# Altium project LUMO_SQUISHO.PrjPcb
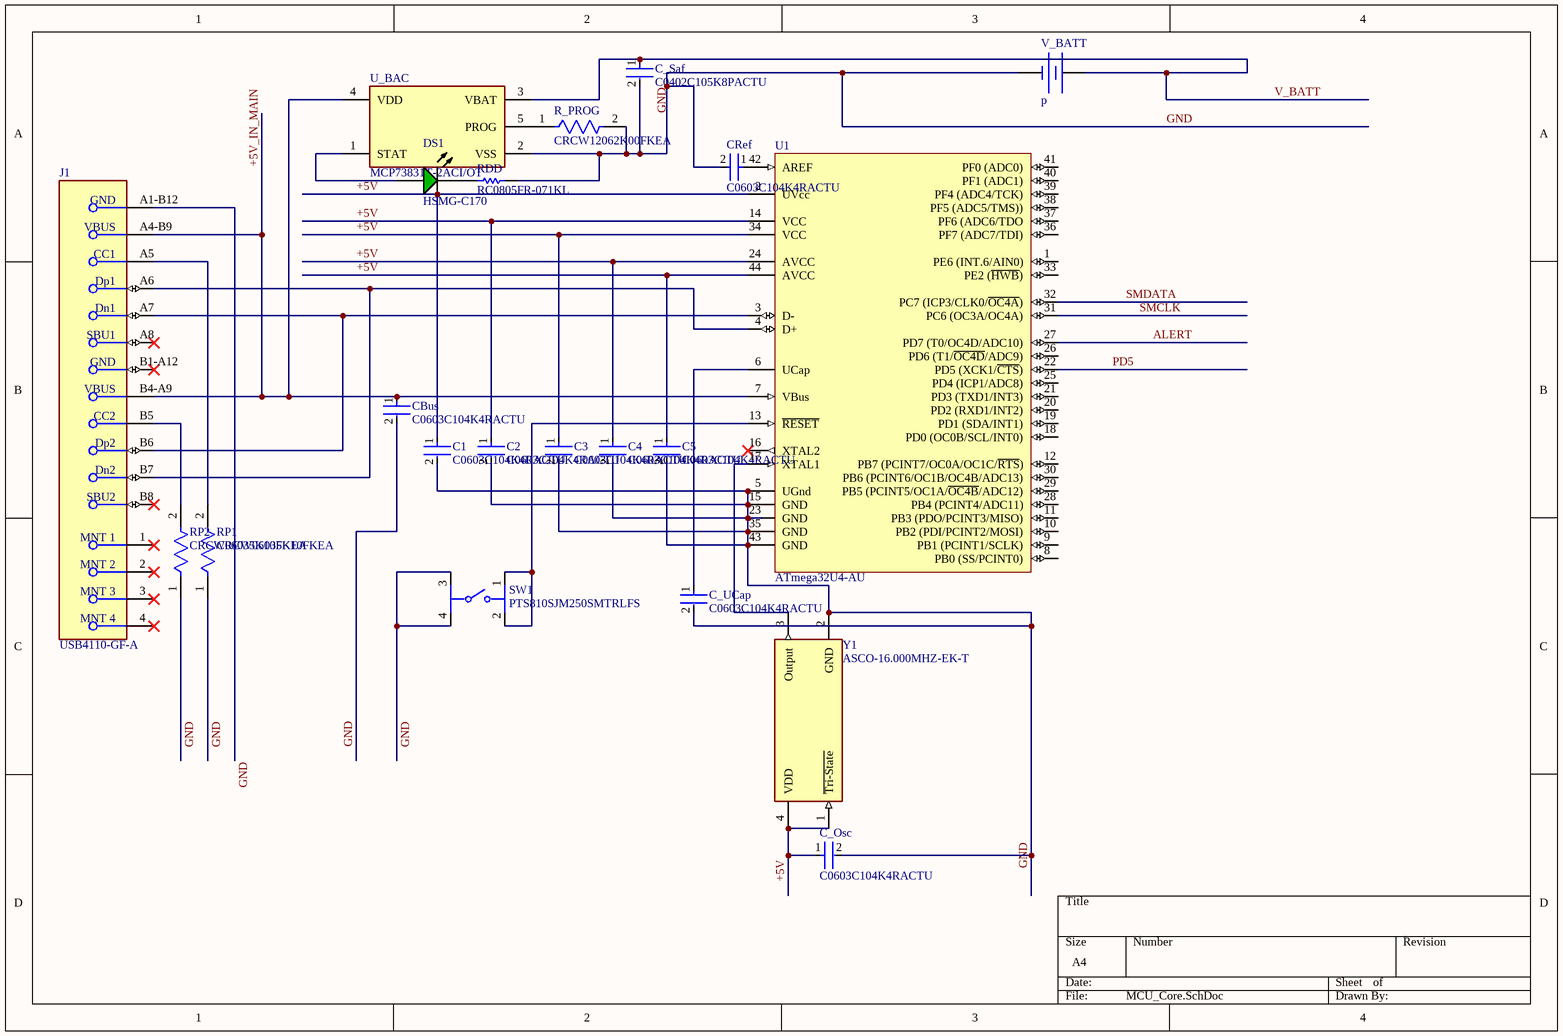
[diagram p0: MCU_Core.SchDoc]
2 sheets, 37 parts. Net scope: global (net labels, ports and power ports of the same name join across sheets).
Board file: PCBMAIN.PcbDoc
Sheets:
  MCU_Core.SchDoc
  LED_Interface.SchDoc

## Sheet MCU_Core.SchDoc
size A4; SheetNumber: 1; SheetTotal: 2

### Parts
C1  C0603C104K4RACTU  [FP-C0603C-CF-MFG]
C2  C0603C104K4RACTU  [FP-C0603C-CF-MFG]
C3  C0603C104K4RACTU  [FP-C0603C-CF-MFG]
C4  C0603C104K4RACTU  [FP-C0603C-CF-MFG]
C5  C0603C104K4RACTU  [FP-C0603C-CF-MFG]
C_Osc  C0603C104K4RACTU  [FP-C0603C-CF-MFG]
C_Saf  C0402C105K8PACTU  [FP-C0402C105K8PACTU-MFG]
C_UCap  C0603C104K4RACTU  [FP-C0603C-CF-MFG]
CBus  C0603C104K4RACTU  [FP-C0603C-CF-MFG]
CRef  C0603C104K4RACTU  [FP-C0603C-CF-MFG]
DS1  HSMG-C170  [AVAG-HSMX-C170_V]
J1  USB4110-GF-A  [FP-USB4110-GF-A-MFG]
R_PROG  CRCW12062K00FKEA  [FP-CRCW1206-e3-IPC_A]
RDD  RC0805FR-071KL  [RESC2013X60X35ML10T20]
RP1  CRCW06035K10FKEA  [FP-CRCW0603-e3-IPC_C]
RP2  CRCW06035K10FKEA  [FP-CRCW0603-e3-IPC_C]
SW1  PTS810SJM250SMTRLFS  [FP-PTS810SJM250SMTRLFS-MFG]
U1  ATmega32U4-AU  [44ML_M]
U_BAC  MCP73831T-2ACI/OT  [FP-C04-091-OT-IPC_B]
V_BATT  DC Magnitude: p  (hidden comment: Constant Voltage Source)
Y1  ASCO-16.000MHZ-EK-T  [FP-ASCO-MFG]

### Nets
GND: C1.2 C2.2 C3.2 C4.2 C5.2 C_Osc.2 C_Saf.2 C_UCap.2 CBus.2 CRef.2 J1.A1-B12(GND) R_PROG.2 RDD.2 RP1.1 RP2.1 SW1.3 SW1.4 U1.5(UGnd) U1.15(GND) U1.23(GND) U1.35(GND) U1.43(GND) U_BAC.2(VSS) V_BATT.2 Y1.2(GND)
+5V: C1.1 C2.1 C3.1 C4.1 C5.1 C_Osc.1 U1.2(UVcc) U1.14(VCC) U1.24(AVCC) U1.34(VCC) U1.44(AVCC) Y1.1(~{Tri-State}) Y1.4(VDD)
+5V_IN_MAIN: CBus.1 J1.A4-B9(VBUS) J1.B4-A9(VBUS) U1.7(VBus) U_BAC.4(VDD)
ALERT: U1.27(PD7_(T0/OC4D/ADC10))
PD5: U1.22(PD5_(XCK1/~{CTS}))
SMCLK: U1.31(PC6_(OC3A/OC4A))
SMDATA: U1.32(PC7_(ICP3/CLK0/~{OC4A}))
V_BATT: C_Saf.1 U_BAC.3(VBAT) V_BATT.1
NetC_UCap_1: C_UCap.1 U1.6(UCap)
NetCRef_1: CRef.1 U1.42(AREF)
NetDS1_1: DS1.1(A) U_BAC.1(STAT)
NetDS1_2: DS1.2(K) RDD.1
NetJ1_A5: J1.A5(CC1) RP1.2
NetJ1_A6: J1.A6(Dp1) J1.B7(Dn2) U1.4(D+)
NetJ1_A7: J1.A7(Dn1) J1.B6(Dp2) U1.3(D-)
NetJ1_B5: J1.B5(CC2) RP2.2
NetR_PROG_1: R_PROG.1 U_BAC.5(PROG)
NetSW1_1: SW1.1 SW1.2 U1.13(~{RESET})
NetU1_17: U1.17(XTAL1) Y1.3(Output)

Not connected (* = marked no-connect by the designer): J1 1(MNT_1)* 2(MNT_2)* 3(MNT_3)* 4(MNT_4)* A8(SBU1)* B1-A12(GND)* B8(SBU2)*; U1 1(PE6_(INT.6/AIN0)) 8(PB0_(SS/PCINT0)) 9(PB1_(PCINT1/SCLK)) 10(PB2_(PDI/PCINT2/MOSI)) 11(PB3_(PDO/PCINT3/MISO)) 12(PB7_(PCINT7/OC0A/OC1C/~{RTS})) 16(XTAL2)* 18(PD0_(OC0B/SCL/INT0)) 19(PD1_(SDA/INT1)) 20(PD2_(RXD1/INT2)) 21(PD3_(TXD1/INT3)) 25(PD4_(ICP1/ADC8)) 26(PD6_(T1/~{OC4D}/ADC9)) 28(PB4_(PCINT4/ADC11)) 29(PB5_(PCINT5/OC1A/~{OC4B}/ADC12)) 30(PB6_(PCINT6/OC1B/OC4B/ADC13)) 33(PE2_(~{HWB})) 36(PF7_(ADC7/TDI)) 37(PF6_(ADC6/TDO) 38(PF5_(ADC5/TMS))) 39(PF4_(ADC4/TCK)) 40(PF1_(ADC1)) 41(PF0_(ADC0))

### Notes on the sheet
- Labels drawn without touching a wire or pin: GND

### Library data of the parts
C1-C5 C_Osc C_UCap CBus CRef = CMP-2006-03811-3: Capacitor; Ceramic; Cap; .100uF; Tol 10%; SMT; Vol-Rtg 16V; X7R; Tape and Reel; Manufacturer: KEMET; Value: 0.10 μF; Temperature Coefficient: 30ppm/°C; Automotive Grade: Grade 1; Tolerance: 0.1; Digikey Description: Capacitor; Ceramic; Cap; .100uF; Tol 10%; SMT; Vol-Rtg 16V; X7R; Tape and Reel; Automotive: Yes; Temperature Range High: +125°C; Device Class L1: Passive Components; Material: Ceramic; Lead Free: Yes; Device Class L2: Capacitors; Capacitance: 0.10 μF; Height: 0.87mm; Voltage Rating: 16 V; Manufacturer Part Number: C0603C104K4RACTU; Octopart: https://octopart.com/c0603c104k4ractu-kemet-93067; Package: C0603C-CF; Temperature Characteristic: X7R; Device Class L3: Ceramic Capacitors; ComponentLink2URL: https://api.kemet.com/component-edge/download/datasheet/C0603C100J5GACAUTO.pdf; Temperature Range Low: -55°C; ComponentLink2Description: Datasheet; Mouser Description: Multilayer Ceramic Capacitors MLCC - SMD/SMT 16volts 0.1uF 10% X7R 10%; RoHS: TRUE; Temperature: -55°C to +125°C; Category: Cap
C_Saf = CMP-2008-02081-2: CAP CER 1UF 10V X5R 0402; Dielectric Material: Ceramic; Dissipation Factor: 5%; Tolerance: 10%; Number of Pins: 2; Contact Plating: Tin; Min Operating Temperature: -55°C; Termination: SMD/SMT; Lead Free: Lead Free; Construction: Flat; Voltage Rating (DC): 10V; Mount: Surface Mount; Series: C; Thickness: 0.022inch; Width: 0.5mm; Radiation Hardening: No; Capacitance: 1uF; Dielectric: X5R; Height: 0.5mm; Voltage: 10V; Length: 1mm; Depth: 0.5mm; Max Operating Temperature: 85°C; Package Quantity: 1; Packaging: Tape and Reel; RoHS Compliant: Yes; Case Code (Imperial): 0402; Case Code (Metric): 1005; REACH SVHC: No SVHC; Voltage Rating: 10V; Case/Package: 0402
DS1 = CMP-2000-05062-1: Chip LED, Green, 2.2 V, -40 to 85 degC, 2-Pin SMD, Pb-Free, Tape and Reel; Manufacturer: Avago; No. of Pins: 2; Peak Wavelength: 570nm; SVHC: NoSVHC(16-Jun-2014); Dominant Wavelength: 572nm; Forward Current If: 20mA; Viewing Angle: 170deg; Lens Shape: Rectangular; PIV Max: 5V; External Width: 1.25mm; LED Type: Standard; External Depth: 0.8mm; Opto Mounting Orientation: Top; Luminous Intensity: 15mcd; Luminous Intensity Min: 4mcd; Forward Voltage VF Max: 2.6V; External Length / Height: 2mm; Bulb Size: 1.25mmx1.4mm; Light Area Height: 1mm; Voltage Vf Typ: 2.2V; Operating Temperature Max: 85degC; Datasheet Version: Oct-08; MSL: MSL2A-4weeks; Peak Forward Current: 20mA; Package Description: 2-Pin Surface Mount Device, Body 2 x 1.25 mm, Height 0.8 mm; Datasheet URL: https://datasheet.ciiva.com/29280/180495-da-01-en-chip-led-hsmg-c170-gelb-gruen-29280971.pdf; Storage Temperature Min: -40degC; LED Colour: Green; Wavelength Typ: 570nm; Mounting Type: SMD; Forward Current If Max: 20mA; Dominant Wavelength Typ: 572nm; LED Mounting: SMD; Operating Temperature Range: -30degCto+85degC; Operating Temperature Min: -30degC; Manufacturer URL: http://www.avagotech.com/; Packaging: CutTape; Luminous Intensity Typ: 15mcd; Package Reference: HSMX-C170; Storage Temperature Max: 85degC; Opto Case Style: SMD; Forward Voltage: 2.2V
J1 = CMP-245163-000002-1: CONN USB 2.0 TYPE-C R/A SMT; Manufacturer: GCT; Conn Orientation: Right Angle; Usb Standard: USB 2.0; Voltage Rating: 20V; Current Rating: 3/4.25/1.25/0.25A; Number Of Contacts: 16; Is Female: yes; Shielding: true; Standoff Height: 0.1mm; Octopart: https://octopart.com/usb4110-gf-a-gct-103941985; Temperature: -40°C to +85°C; RoHS: TRUE; Automotive: No; Contact Material: Gold,Nickel; Device Class L1: Connectors; Device Class L2: USB Connectors; Package: 0; Lead Free: Yes; ComponentLink2URL: https://gct.co/files/drawings/usb4110.pdf; Temperature Range High: +85°C; Temperature Range Low: -40°C; Height: 3.46mm; Manufacturer Part Number: USB4110-GF-A; ComponentLink2Description: Datasheet; Device Class L3: unset; Digikey Description: CONN USB 2.0 TYPE-C R/A SMT; Category: Conn
R_PROG = CMP-1014-00542-3: RES Thick Film, 2kΩ, 1%, 0.25W, 100ppm/°C, 1206; Max Power Dissipation: 250mW; Voltage Rating: 200V; Resistance: 2kR; Package Quantity: 10; Height: 0.55mm; Tolerance: 1%; Number of Terminations: 2; Mount: Surface Mount; Width: 1.6mm; Length: 3.2mm; Features: Automotive AEC-Q200; Contact Plating: Tin; Number of Pins: 2; Weight: 0.000353oz; Max Operating Temperature: 155°C; Min Operating Temperature: -55°C; Termination: SMD/SMT; Temperature Coefficient: 100ppm/°C; Case Code (Imperial): 1206; Depth: 1.6mm; Military Standard: Not; Case Code (Metric): 3216; Composition: Thick Film; Power Rating: 250mW; Case/Package: 1206; Radiation Hardening: No; Packaging: Tape and Reel
RDD = CMP-2100-03671-1: Chip Resistor, 1 KOhm, +/- 1%, 125 mW, -55 to 155 degC, 0805 (2012 Metric), RoHS, Tape and Reel; Manufacturer: Yageo; Temperature Coefficient: 100ppm/degreesC; Voltage Rating (DC): 150V; Max Power Dissipation: 125mW; Resistance: 1KOhm; Number of Pins: 2; Number of Terminations: 2; Datasheet URL: http://www.yageo.com/NewPortal/yageodocoutput?fileName=/pdf/R-Chip/PYu-RC_Group_51_RoHS_L_5.pdf; Length: 0.079inch; Package Description: 2-Pin Surface Mounted Device, Body 2 x 1.25 mm; Depth: 1.25mm; Height: 0.024inch; Military Standard: Not; Case/Package: 0805; Package Reference: 0805; RoHSCompliant: true; Lead Free: LeadFree; Packaging: TapeandReel; Package Quantity: 1; Datasheet Version: Rev. 5, 10/2016; Tolerance: 1%; Min Operating Temperature: -55degC; Voltage Rating: 150V; Composition: ThickFilm; Case Code (Imperial): 0805; Power Rating: 125mW; Width: 0.049inch; Case Code (Metric): 2012; Manufacturer URL: http://www.yageo.com/; Max Operating Temperature: 155degC; REACH SVHC: Unknown; Termination: SMD/SMT
RP1 RP2 = CMP-1012-00590-3: RES Thick Film, 5.1kΩ, 1%, 0.1W, 100ppm/°C, 0603; Power Rating: 100mW; Voltage Rating (DC): 75V; Resistance: 5.1kR; Width: 0.85mm; Depth: 0.85mm; Military Standard: Not; Package Quantity: 5000; Case Code (Metric): 1608; Length: 1.55mm; Weight: 7.1E-05oz; Packaging: Tape and Reel; Temperature Coefficient: 100ppm/°C; Case Code (Imperial): 0603; Lead Free: Lead Free; Radiation Hardening: No; Contact Plating: Tin; Composition: Thick Film; Max Operating Temperature: 155°C; Termination: SMD/SMT; Case/Package: 0603; Min Operating Temperature: -55°C; Tolerance: 1%; Voltage Rating: 75V; Mount: Surface Mount; Height: 0.45mm
SW1 = CMP-10040-000001-2: SWITCH TACTILE SPST-NO 0.05A 16V; Throw Configuration: SPST; Operating Force: 160gf; Actuator Type: Standard; Switch Travel: 0.15mm; Switch Function: Off-Mom; Max Current Rating: 50mA; Mechanical Life: 150000Cycles; Illumination Type: Non-Illuminated; Package Quantity: 2900; Depth: 4.6mm; Mount: Surface Mount; Packaging: Tape and Reel; Length: 3.2mm; RoHS Compliant: Yes; Case/Package: SMD/SMT; Voltage Rating (DC): 16V; Min Operating Temperature: -40°C; Termination: J-Bend; Lead Free: Lead Free; Contact Plating: Silver; Orientation: Straight; Max Operating Temperature: 85°C; Current Rating: 50mA; Color: Black
U1 = CMP-0095-00285-2: 8-bit AVR Microcontroller, 2.7-5.5V, 16MHz, 32KB Flash, 1KB EEPROM, 2.5KB SRAM, USB Controller, 44-pin TQFP, Industrial Grade (-40°C to 85°C), Ext Osc; RevisionNote: DatasheetVersion updated. URLs added.; ComponentLink1Description: Manufacturer URL; PackageDescription: 44-Pin Plastic Thin Quad Flat Pack, 10 x 10 x 1.0 mm Body, 0.8 mm Pitch (TQFP); DatasheetVersion: revF, Nov-2010; ComponentLink2URL: http://www.atmel.com/dyn/resources/prod_documents/doc7766.pdf; ComponentLink1URL: http://www.atmel.com/; PackageReference: 44ML; ComponentLink2Description: ATmega16U4/32U4 Datasheet; PackageVersion: rev.G, Jul-2007; ComponentLink3URL: http://www.atmel.com/dyn/resources/prod_documents/7766S.pdf; ComponentLink3Description: ATmega16U4 ATmega32U4 Summary
U_BAC = CMP-0133-00143-2: IC CONTROLLR LI-ION 4.2V SOT23-5; Max Power Dissipation: 1.54W; Output Current: 500mA; Max Output Voltage: 4.5V; Number of Outputs: 1; Min Output Voltage: 4.168V; Min Supply Voltage: 3.75V; Max Input Voltage: 6V; Voltage Rating: 4.534V; Drain to Source Resistance: 350mR; Max Operating Temperature: 85°C; Length: 0.122inch; Number of Pins: 5; REACH SVHC: No SVHC; Radiation Hardening: No; Min Operating Temperature: -40°C; Weight: 0.00709oz; Contact Plating: Tin; Termination: SMD/SMT; Case/Package: SOT-23; Mount: Surface Mount; Width: 0.071inch; Packaging: Tape and Reel; Number of Cells: 1; Max Charge Current: 500mA; Height: 0.051inch; Number of Channels: 1; Output Voltage: 4.2V; Max Supply Voltage: 6V; Lead Free: Lead Free
V_BATT = Battery: SimulationGenericComponent: True
Y1 = CMP-27762-012766-1: Crystal Oscillator 16MHz ±30ppm CMOS 3.3V SMD 1.6x1.2mm; Max Supply Current: 4.5mA; Load Capacitance: 15pF; Max Supply Voltage: 3.63V; Min Supply Voltage: 2.97V; Width: 0.047inch; Number of Pins: 4; Length: 0.063inch; Packaging: Tape and Reel; Mount: Surface Mount; Case/Package: SMD/SMT; Height: 0.028inch; Operating Supply Voltage: 3.3V; Max Operating Temperature: 70°C; Min Operating Temperature: -20°C; Package Quantity: 1000; Frequency Stability: 30ppm; Frequency: 16MHz; Termination: SMD/SMT; RoHS Compliant: Yes

## Sheet LED_Interface.SchDoc
size A4; SheetNumber: 2; SheetTotal: 2
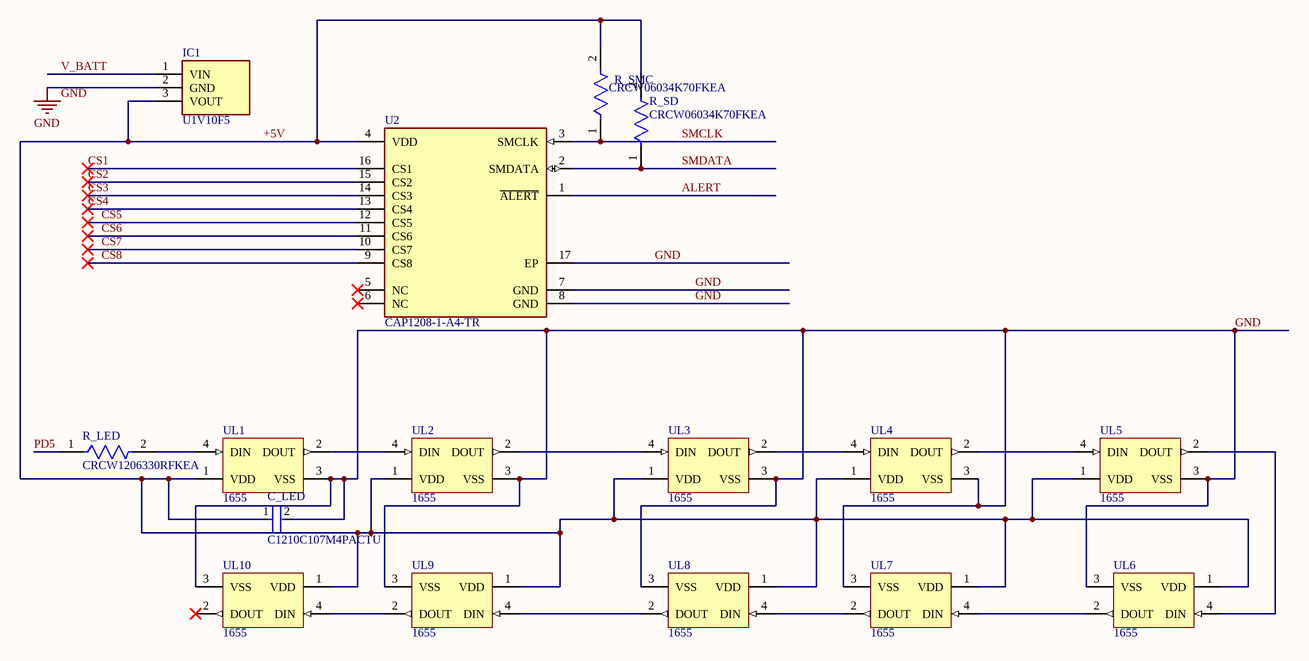
[diagram p1: LED_Interface.SchDoc]

### Parts
C_LED  C1210C107M4PACTU  [FP-C1210C-FS-MFG]
IC1  U1V10F5  [U1V10F5]
R_LED  CRCW1206330RFKEA  [FP-CRCW1206-e3-IPC_A]
R_SD  CRCW06034K70FKEA  [FP-CRCW0603-e3-IPC_A]
R_SMC  CRCW06034K70FKEA  [FP-CRCW0603-e3-IPC_A]
U2  CAP1208-1-A4-TR  [FP-CAP1208-1-A4-TR-MFG]
UL1  1655  [ADA-RGB-1655_V]
UL2  1655  [ADA-RGB-1655_V]
UL3  1655  [ADA-RGB-1655_V]
UL4  1655  [ADA-RGB-1655_V]
UL5  1655  [ADA-RGB-1655_V]
UL6  1655  [ADA-RGB-1655_V]
UL7  1655  [ADA-RGB-1655_V]
UL8  1655  [ADA-RGB-1655_V]
UL9  1655  [ADA-RGB-1655_V]
UL10  1655  [ADA-RGB-1655_V]

### Nets
GND: C_LED.2 IC1.2(GND) U2.7(GND) U2.8(GND) U2.17(EP) UL1.3(VSS) UL2.3(VSS) UL3.3(VSS) UL4.3(VSS) UL5.3(VSS) UL6.3(VSS) UL7.3(VSS) UL8.3(VSS) UL9.3(VSS) UL10.3(VSS)
+5V: C_LED.1 IC1.3(VOUT) R_SD.2 R_SMC.2 U2.4(VDD) UL1.1(VDD) UL2.1(VDD) UL3.1(VDD) UL4.1(VDD) UL5.1(VDD) UL6.1(VDD) UL7.1(VDD) UL8.1(VDD) UL9.1(VDD) UL10.1(VDD)
ALERT: U2.1(~{ALERT})
CS1: U2.16(CS1)
CS2: U2.15(CS2)
CS3: U2.14(CS3)
CS4: U2.13(CS4)
CS5: U2.12(CS5)
CS6: U2.11(CS6)
CS7: U2.10(CS7)
CS8: U2.9(CS8)
PD5: R_LED.1
SMCLK: R_SMC.1 U2.3(SMCLK)
SMDATA: R_SD.1 U2.2(SMDATA)
V_BATT: IC1.1(VIN)
NetR_LED_2: R_LED.2 UL1.4(DIN)
NetUL1_2: UL1.2(DOUT) UL2.4(DIN)
NetUL2_2: UL2.2(DOUT) UL3.4(DIN)
NetUL3_2: UL3.2(DOUT) UL4.4(DIN)
NetUL4_2: UL4.2(DOUT) UL5.4(DIN)
NetUL5_2: UL5.2(DOUT) UL6.4(DIN)
NetUL6_2: UL6.2(DOUT) UL7.4(DIN)
NetUL7_2: UL7.2(DOUT) UL8.4(DIN)
NetUL8_2: UL8.2(DOUT) UL9.4(DIN)
NetUL9_2: UL9.2(DOUT) UL10.4(DIN)

Not connected (* = marked no-connect by the designer): U2 5(NC)* 6(NC)*; UL10 2(DOUT)*

### Notes on the sheet
- Labels drawn without touching a wire or pin: GND

### Library data of the parts
C_LED = CMP-03020-034653-1: CAP CER 100UF 16V X5R 1210; Tolerance: 20%; Dielectric Material: Ceramic; Max Operating Temperature: 85°C; REACH SVHC: No SVHC; Case Code (Metric): 3225; Case/Package: 1210; Thickness: 0.106inch; Length: 3.2mm; Min Operating Temperature: -55°C; Voltage Rating (DC): 16V; Weight: 0.000564oz; Packaging: Tape and Reel; Case Code (Imperial): 1210; Depth: 2.5mm; Lead Free: Lead Free; Width: 0.098inch; Voltage Rating: 16V; Capacitance: 100uF; Termination: SMD/SMT; Dielectric: X5R; Package Quantity: 1000
IC1 = U1V10F5: Integrated Circuit; Manufacturer_Name: Pololu; Datasheet Link: https://www.pololu.com/product/2564; Height: 2.72mm; Manufacturer_Part_Number: U1V10F5
R_LED = CMP-2003-02098-2: RES Thick Film, 330Ω, 1%, 0.25W, 100ppm/°C, 1206; Voltage Rating: 200V; Resistance: 330R; Max Power Dissipation: 250mW; Height: 0.55mm; Mount: Surface Mount; Min Operating Temperature: -55°C; Depth: 1.6mm; Features: Automotive AEC-Q200; Voltage Rating (DC): 200V; Military Standard: Not; Packaging: Tape and Reel; Composition: Thick Film; Contact Plating: Tin; Case Code (Imperial): 1206; Case/Package: 1206; Number of Terminations: 2; Length: 3.2mm; Lead Free: Lead Free; Tolerance: 1%; Temperature Coefficient: 100ppm/°C; Case Code (Metric): 3216; Width: 1.6mm; Weight: 0.000353oz; Termination: SMD/SMT; Radiation Hardening: No; Package Quantity: 10; Power Rating: 250mW; Max Operating Temperature: 155°C
R_SD R_SMC = CMP-1666-00019-3: RES Thick Film, 4.7kΩ, 1%, 0.1W, 100ppm/°C, 0603; Resistance: 4.7kR; Voltage Rating: 75V; Power Rating: 100mW; Case Code (Metric): 1608; Military Standard: Not; Packaging: Tape and Reel; Termination: SMD/SMT; Temperature Coefficient: 100ppm/°C; Lead Free: Lead Free; Length: 1.55mm; Width: 0.85mm; Height: 0.45mm; Depth: 0.85mm; Weight: 7.1E-05oz; Case Code (Imperial): 0603; Contact Plating: Tin; Case/Package: 0603; Max Operating Temperature: 155°C; Mount: Surface Mount; Tolerance: 1%; Min Operating Temperature: -55°C; Package Quantity: 5000; Voltage Rating (DC): 75V; Composition: Thick Film
U2 = CMP-06270-000011-1: IC TOUCH SENSOR CAP 8CH 16QFN; Touchscreen: Capacitive; Operating Supply Current: 500uA; Max Supply Voltage: 5.5V; Number of Channels: 8; Interface: I2C; Min Supply Voltage: 3V; Operating Supply Voltage: 5V; Case/Package: QFN; Packaging: Tape and Reel; Series: -; Mount: Surface Mount; RoHS Compliant: Yes; Width: 3mm; Number of Pins: 16; Min Operating Temperature: -40°C; Length: 3mm; REACH SVHC: No SVHC; Supply Current: 500uA; Max Operating Temperature: 125°C; Package Quantity: 5000; Number of Inputs: 8; Termination: SMD/SMT; Nominal Supply Current: 500uA
UL1-UL10 = CMP-2000-05026-1: Intelligent Control LED Integrated Light Source, 3.5 to 5.3 V, -25 to 80 degC, 4-Pin SMD, RoHS, Tape and Reel; Manufacturer: Adafruit-Industries-LLC; Number of LEDs: 10; Configuration: Discrete; Utilized LED: WS2812(5050); Datasheet URL: http://datasheet.octopart.com/ADA1655-Adafruit-Industries-datasheet-32028139.pdf; Series: Neopixel; Interface: -; Package Description: 4-Pin Surface Mount Device, Body 5 x 5 mm; Color: Red,Green,Blue(RGB); Category: Optoelectronics; Controller Type: -; Package Reference: 1655; Manufacturer URL: https://www.adafruit.com/; Mounting Type: SurfaceMount; Datasheet Version: May-13; Size / Dimension: 5.00mmLx5.00mmW; Family: Addressable,Specialty

## Nets that join several sheets
GND: MCU_Core (25 pins), LED_Interface (15 pins)
+5V: MCU_Core (13 pins), LED_Interface (15 pins)
ALERT: MCU_Core (U1.27), LED_Interface (U2.1)
PD5: MCU_Core (U1.22), LED_Interface (R_LED.1)
SMCLK: MCU_Core (U1.31), LED_Interface (R_SMC.1 U2.3)
SMDATA: MCU_Core (U1.32), LED_Interface (R_SD.1 U2.2)
V_BATT: MCU_Core (C_Saf.1 U_BAC.3 V_BATT.1), LED_Interface (IC1.1)